# EAGLE schematic finalprojeagle (EAGLE 6.2)
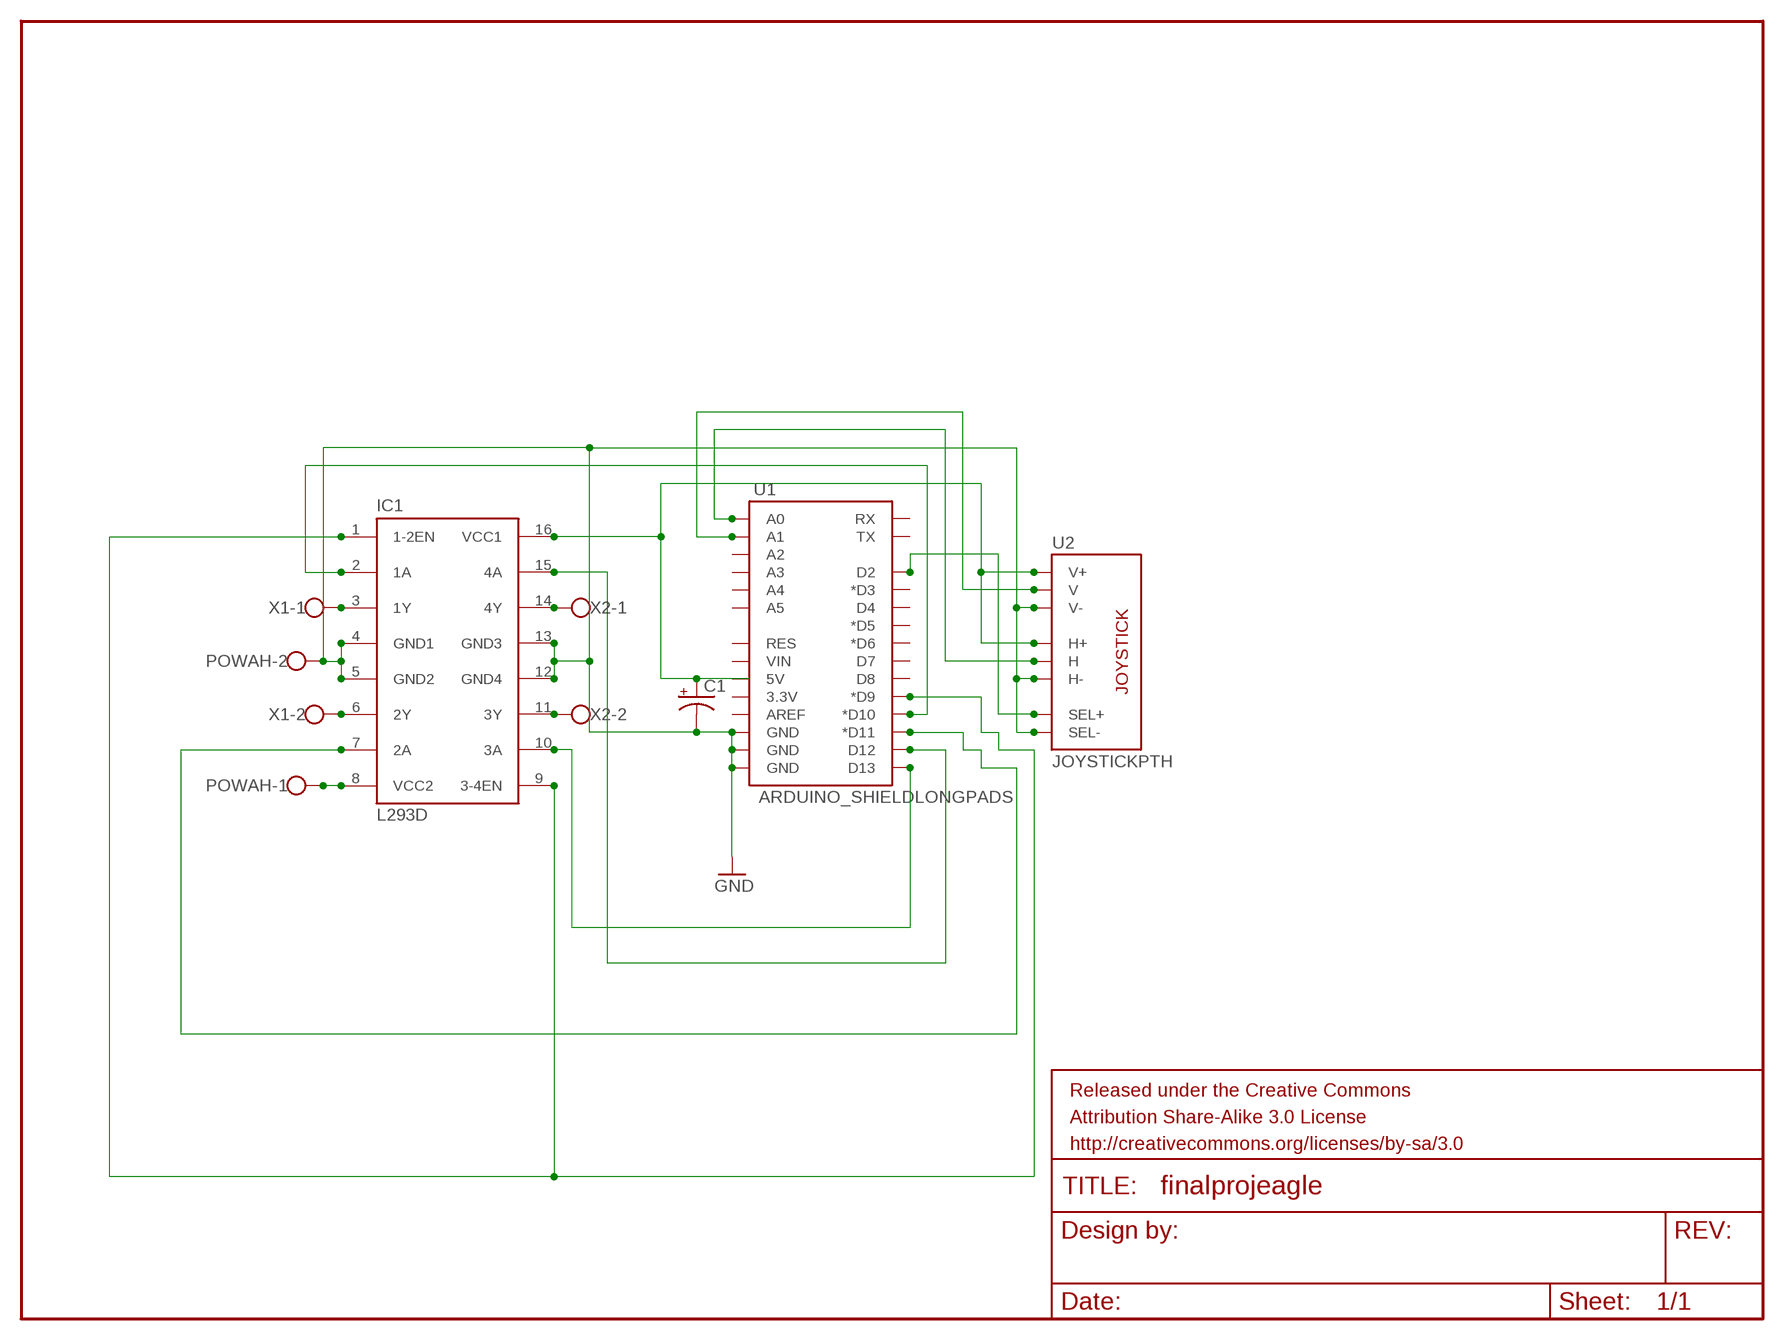
[diagram p0: schematic, sheet 1]

## Parts
C1  CAP_POLPTH2  [CPOL-RADIAL-10UF-25V]
FRAME1  FRAME-LETTER  [CREATIVE_COMMONS]
IC1  L293D  [DIL16]
POWAH  W237-102  [W237-102]
U1  ARDUINO_SHIELDLONGPADS  [DUEMILANOVE_SHIELD_LONGPADS]
U2  JOYSTICKPTH  [JOYSTICK]
X1  W237-102  [W237-102]
X2  W237-102  [W237-102]

## Nets
GND: C1.2(-) IC1.4(GND1) IC1.5(GND2) IC1.12(GND4) IC1.13(GND3) POWAH.2 U1.GND@0(GND) U1.GND@1(GND) U1.GND@2(GND) U2.B2A(SEL-) U2.H3(H-) U2.V3(V-)
N$1: C1.1(+) IC1.16(VCC1) U1.5V U2.H1(H+) U2.V1(V+)
N$2: IC1.8(VCC2) POWAH.1
N$3: IC1.3(1Y) X1.1
N$4: IC1.6(2Y) X1.2
N$5: IC1.14(4Y) X2.1
N$6: IC1.11(3Y) X2.2
N$7: U1.A1 U2.V2(V)
N$8: U1.A0 U2.H2(H)
N$9: U1.D2 U2.B1A(SEL+)
N$10: IC1.2(1A) U1.D10(*D10)
N$11: IC1.1(1-2EN) IC1.9(3-4EN) U1.D9(*D9)
N$12: IC1.7(2A) U1.D11(*D11)
N$13: IC1.15(4A) U1.D12
N$14: IC1.10(3A) U1.D13
Unconnected: U1.3.3V U1.A2 U1.A3 U1.A4 U1.A5 U1.AREF U1.D3(*D3) U1.D4 U1.D5(*D5) U1.D6(*D6) U1.D7 U1.D8 U1.RES U1.RX U1.TX U1.VIN

## Library data of the parts
C1 = SparkFun-Capacitors:CAP_POL: Capacitor Polarized These are standard SMD and PTH capacitors. Normally 10uF, 47uF, and 100uF in electrolytic and tantalum varieties. Always verify the external diameter of the through hole cap, it varies with capacity, voltage, and manufacturer. The EIA devices should be standard.
FRAME1 = SparkFun-Aesthetics:FRAME-LETTER: Schematic Frame Standard 8.5x11 US Letter frame
IC1 = st-microelectronics:L293D: PUSH-PULL 4 CHANNEL DRIVER; MPN: L293D; OC_FARNELL: 9589619; OC_NEWARK: 56P8249
POWAH X1 X2 = con-wago-500:W237-102: WAGO SCREW CLAMP; MPN: 237-102; OC_FARNELL: unknown; OC_NEWARK: 70K9898
U1 = SparkFun-Boards:ARDUINO_SHIELD: Arduino shield footprint
U2 = SparkFun-Electromechanical:JOYSTICK: Thumb Joystick Joystick commonly found in PS2 controllers. Two pots and a select switch. Footprint proven. Spark Fun Electronics SKU : COM-09032